# Altium project PCB_Project1.PrjPCB
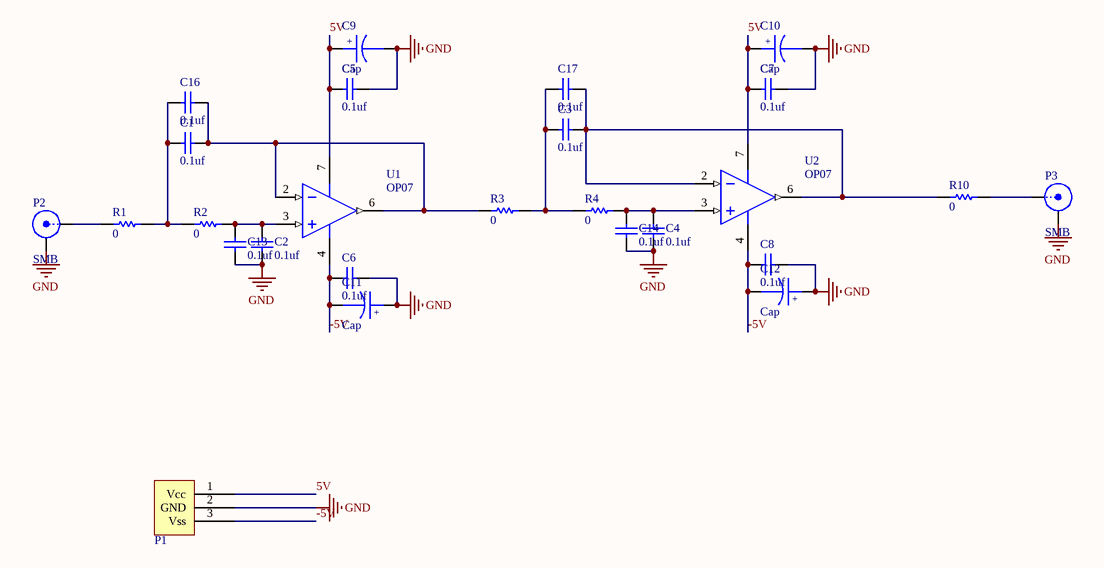
[diagram p0: Sheet1.SchDoc]
1 sheet, 26 parts. Net scope: global (net labels, ports and power ports of the same name join across sheets).
Board file: PCB1.PcbDoc

## Sheet Sheet1.SchDoc
size A4

### Parts
C1  0.1uf  [0805]
C2  0.1uf  [0805]
C3  0.1uf  [0805]
C4  0.1uf  [0805]
C5  0.1uf  [0805]
C6  0.1uf  [0805]
C7  0.1uf  [0805]
C8  0.1uf  [0805]
C9  Cap  [3216C-TYPE_A]
C10  Cap  [3216C-TYPE_A]
C11  Cap  [3216C-TYPE_A]
C12  Cap  [3216C-TYPE_A]
C13  0.1uf  [0805]
C14  0.1uf  [0805]
C16  0.1uf  [0805]
C17  0.1uf  [0805]
P1  XH2.54-3p  [XH2.54-3p]  (value not drawn)
P2  SMB  [SMB_V-RJ45]
P3  SMB  [SMB_V-RJ45]
R1  0  [0805]
R2  0  [0805]
R3  0  [0805]
R4  0  [0805]
R10  0  [0805]
U1  OP07  [TI-JG8]
U2  OP07  [TI-JG8]

### Nets
GND: C2.2 C4.1 C5.2 C6.2 C7.2 C8.2 C9.2 C10.2 C11.1 C12.1 C13.1 C14.1 P1.2(GND) P2.2(Y) P3.2(Y)
5V: C5.1 C7.1 C9.1 C10.1 P1.1(Vcc) U1.7(V+) U2.7(V+)
-5V: C6.1 C8.1 C11.2 C12.2 P1.3(Vss) U1.4(V-) U2.4(V-)
NetC1_1: C1.1 C16.1 R3.1 U1.2(IN-) U1.6(OUT)
NetC1_2: C1.2 C16.2 R1.2 R2.1
NetC2_1: C2.1 C13.2 R2.2 U1.3(IN+)
NetC3_1: C3.1 C17.2 R3.2 R4.1
NetC3_2: C3.2 C17.1 R10.1 U2.2(IN-) U2.6(OUT)
NetC4_2: C4.2 C14.2 R4.2 U2.3(IN+)
NetP2_1: P2.1(X) R1.1
NetP3_1: P3.1(X) R10.2

### Notes on the sheet
- (in symbol Tantalium Cap) +
- (in symbol Cap) +

### Library data of the parts
C1-C4 = cap
C5-C8 C13 C14 C16 C17 = Cap
C9-C12 = Tantalium Cap
P2 P3 = SMB: SMB Straight Connector; LatestRevisionDate: 17-Jul-2002; LatestRevisionNote: Re-released for DXP Platform.; Publisher: Altium Limited
R1-R4 R10 = Res